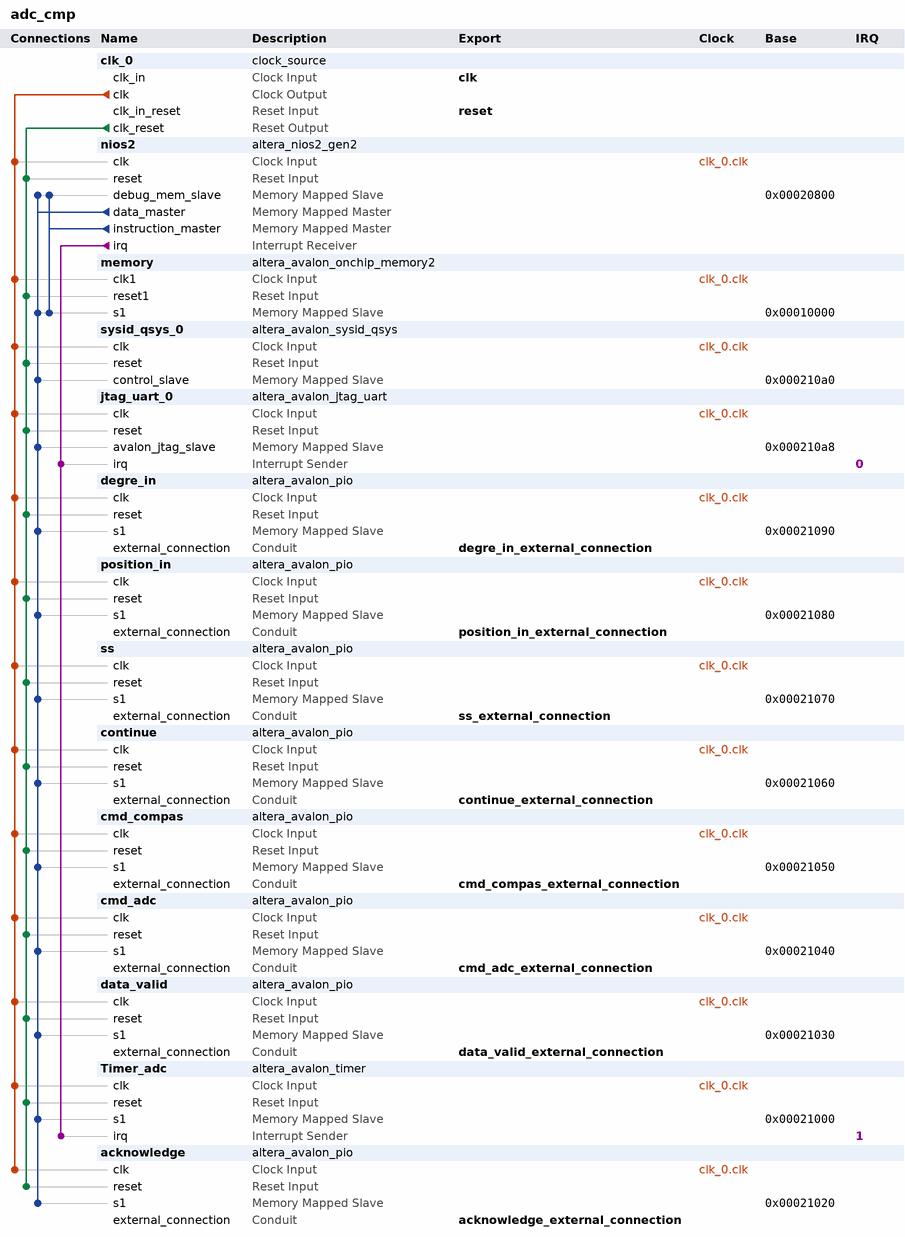
[diagram p0: system contents]
# Platform Designer (Qsys) system adc_cmp, Cyclone IV E EP4CE22F17C6
# Parameters at their usual value, and those the tool derives, are not listed.
package require -exact qsys 18.1
create_system adc_cmp
set_project_property DEVICE_FAMILY {Cyclone IV E}
set_project_property DEVICE EP4CE22F17C6

add_instance clk_0 clock_source 18.1
set_instance_parameter_value clk_0 clockFrequency 50000000

add_instance nios2 altera_nios2_gen2 18.1
set_instance_parameter_value nios2 dcache_size 2048
set_instance_parameter_value nios2 exceptionSlave memory.s1
set_instance_parameter_value nios2 icache_size 4096
set_instance_parameter_value nios2 impl Tiny
set_instance_parameter_value nios2 resetSlave memory.s1

add_instance memory altera_avalon_onchip_memory2 18.1
set_instance_parameter_value memory dataWidth 32
set_instance_parameter_value memory dualPort false
set_instance_parameter_value memory initMemContent true
set_instance_parameter_value memory initializationFileName onchip_mem.hex
set_instance_parameter_value memory memorySize 40000

add_instance sysid_qsys_0 altera_avalon_sysid_qsys 18.1
set_instance_parameter_value sysid_qsys_0 id 0

add_instance jtag_uart_0 altera_avalon_jtag_uart 18.1
set_instance_parameter_value jtag_uart_0 simInteractiveOptions NO_INTERACTIVE_WINDOWS

add_instance degre_in altera_avalon_pio 18.1
set_instance_parameter_value degre_in direction Input
set_instance_parameter_value degre_in width 9

add_instance position_in altera_avalon_pio 18.1
set_instance_parameter_value position_in direction Input
set_instance_parameter_value position_in width 12

add_instance ss altera_avalon_pio 18.1
set_instance_parameter_value ss direction Input
set_instance_parameter_value ss width 1

add_instance continue altera_avalon_pio 18.1
set_instance_parameter_value continue direction Input
set_instance_parameter_value continue width 1

add_instance cmd_compas altera_avalon_pio 18.1
set_instance_parameter_value cmd_compas direction Output
set_instance_parameter_value cmd_compas width 1

add_instance cmd_adc altera_avalon_pio 18.1
set_instance_parameter_value cmd_adc direction Output
set_instance_parameter_value cmd_adc width 1

add_instance data_valid altera_avalon_pio 18.1
set_instance_parameter_value data_valid direction Output
set_instance_parameter_value data_valid width 1

add_instance Timer_adc altera_avalon_timer 18.1
set_instance_parameter_value Timer_adc period 100
set_instance_parameter_value Timer_adc periodUnits MSEC

add_instance acknowledge altera_avalon_pio 18.1
set_instance_parameter_value acknowledge direction Input
set_instance_parameter_value acknowledge width 1

# connections
add_connection clk_0.clk acknowledge.clk clock
add_connection clk_0.clk cmd_adc.clk clock
add_connection clk_0.clk cmd_compas.clk clock
add_connection clk_0.clk continue.clk clock
add_connection clk_0.clk data_valid.clk clock
add_connection clk_0.clk degre_in.clk clock
add_connection clk_0.clk jtag_uart_0.clk clock
add_connection clk_0.clk memory.clk1 clock
add_connection clk_0.clk nios2.clk clock
add_connection clk_0.clk position_in.clk clock
add_connection clk_0.clk ss.clk clock
add_connection clk_0.clk sysid_qsys_0.clk clock
add_connection clk_0.clk Timer_adc.clk clock
add_connection clk_0.clk_reset acknowledge.reset reset
add_connection clk_0.clk_reset cmd_adc.reset reset
add_connection clk_0.clk_reset cmd_compas.reset reset
add_connection clk_0.clk_reset continue.reset reset
add_connection clk_0.clk_reset data_valid.reset reset
add_connection clk_0.clk_reset degre_in.reset reset
add_connection clk_0.clk_reset jtag_uart_0.reset reset
add_connection clk_0.clk_reset memory.reset1 reset
add_connection clk_0.clk_reset nios2.reset reset
add_connection clk_0.clk_reset position_in.reset reset
add_connection clk_0.clk_reset ss.reset reset
add_connection clk_0.clk_reset sysid_qsys_0.reset reset
add_connection clk_0.clk_reset Timer_adc.reset reset
add_connection nios2.data_master acknowledge.s1 avalon
set_connection_parameter_value nios2.data_master/acknowledge.s1 baseAddress 0x00021020
add_connection nios2.data_master cmd_adc.s1 avalon
set_connection_parameter_value nios2.data_master/cmd_adc.s1 baseAddress 0x00021040
add_connection nios2.data_master cmd_compas.s1 avalon
set_connection_parameter_value nios2.data_master/cmd_compas.s1 baseAddress 0x00021050
add_connection nios2.data_master continue.s1 avalon
set_connection_parameter_value nios2.data_master/continue.s1 baseAddress 0x00021060
add_connection nios2.data_master data_valid.s1 avalon
set_connection_parameter_value nios2.data_master/data_valid.s1 baseAddress 0x00021030
add_connection nios2.data_master degre_in.s1 avalon
set_connection_parameter_value nios2.data_master/degre_in.s1 baseAddress 0x00021090
add_connection nios2.data_master jtag_uart_0.avalon_jtag_slave avalon
set_connection_parameter_value nios2.data_master/jtag_uart_0.avalon_jtag_slave baseAddress 0x000210a8
add_connection nios2.data_master memory.s1 avalon
set_connection_parameter_value nios2.data_master/memory.s1 baseAddress 0x00010000
add_connection nios2.data_master nios2.debug_mem_slave avalon
set_connection_parameter_value nios2.data_master/nios2.debug_mem_slave baseAddress 0x00020800
add_connection nios2.data_master position_in.s1 avalon
set_connection_parameter_value nios2.data_master/position_in.s1 baseAddress 0x00021080
add_connection nios2.data_master ss.s1 avalon
set_connection_parameter_value nios2.data_master/ss.s1 baseAddress 0x00021070
add_connection nios2.data_master sysid_qsys_0.control_slave avalon
set_connection_parameter_value nios2.data_master/sysid_qsys_0.control_slave baseAddress 0x000210a0
add_connection nios2.data_master Timer_adc.s1 avalon
set_connection_parameter_value nios2.data_master/Timer_adc.s1 baseAddress 0x00021000
add_connection nios2.instruction_master memory.s1 avalon
set_connection_parameter_value nios2.instruction_master/memory.s1 baseAddress 0x00010000
add_connection nios2.instruction_master nios2.debug_mem_slave avalon
set_connection_parameter_value nios2.instruction_master/nios2.debug_mem_slave baseAddress 0x00020800
add_connection nios2.irq jtag_uart_0.irq interrupt
set_connection_parameter_value nios2.irq/jtag_uart_0.irq irqNumber 0
add_connection nios2.irq Timer_adc.irq interrupt
set_connection_parameter_value nios2.irq/Timer_adc.irq irqNumber 1

# exported interfaces
add_interface acknowledge_external_connection conduit end
set_interface_property acknowledge_external_connection EXPORT_OF acknowledge.external_connection
add_interface clk clock sink
set_interface_property clk EXPORT_OF clk_0.clk_in
add_interface cmd_adc_external_connection conduit end
set_interface_property cmd_adc_external_connection EXPORT_OF cmd_adc.external_connection
add_interface cmd_compas_external_connection conduit end
set_interface_property cmd_compas_external_connection EXPORT_OF cmd_compas.external_connection
add_interface continue_external_connection conduit end
set_interface_property continue_external_connection EXPORT_OF continue.external_connection
add_interface data_valid_external_connection conduit end
set_interface_property data_valid_external_connection EXPORT_OF data_valid.external_connection
add_interface degre_in_external_connection conduit end
set_interface_property degre_in_external_connection EXPORT_OF degre_in.external_connection
add_interface position_in_external_connection conduit end
set_interface_property position_in_external_connection EXPORT_OF position_in.external_connection
add_interface reset reset sink
set_interface_property reset EXPORT_OF clk_0.clk_in_reset
add_interface ss_external_connection conduit end
set_interface_property ss_external_connection EXPORT_OF ss.external_connection

set_interconnect_requirement {$system} qsys_mm.clockCrossingAdapter HANDSHAKE
set_interconnect_requirement {$system} qsys_mm.enableEccProtection FALSE
set_interconnect_requirement {$system} qsys_mm.insertDefaultSlave FALSE
set_interconnect_requirement {$system} qsys_mm.maxAdditionalLatency 1

save_system adc_cmp.qsys
